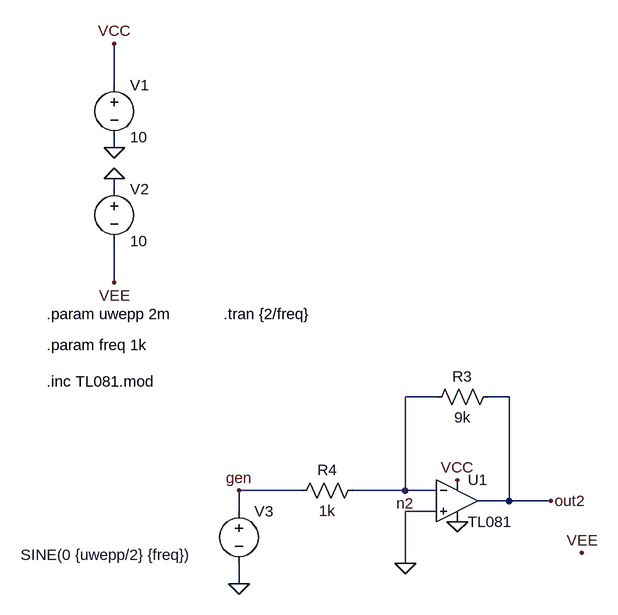
[diagram p0: schematic Draft1.asc]
Draft1.asc, the LTspice schematic file:
Version 4
SHEET 1 880 680
WIRE -128 -256 -128 -320
WIRE -128 -160 -128 -176
WIRE -128 -96 -128 -112
WIRE -128 48 -128 -16
WIRE 368 224 320 224
WIRE 480 224 448 224
WIRE 160 368 64 368
WIRE 320 368 320 224
WIRE 320 368 240 368
WIRE 368 368 320 368
WIRE 480 384 480 224
WIRE 480 384 432 384
WIRE 544 384 480 384
WIRE 64 400 64 368
WIRE 368 400 320 400
WIRE 320 480 320 400
WIRE 64 512 64 480
FLAG -128 -160 0
FLAG -128 -112 0
FLAG -128 -320 VCC
FLAG -128 48 VEE
FLAG 592 464 VEE
FLAG 400 352 VCC
FLAG 64 512 0
FLAG 320 480 0
FLAG 544 384 out2
FLAG 64 368 gen
FLAG 320 368 n2
FLAG 400 416 0
SYMBOL voltage -128 -272 R0
WINDOW 123 0 0 Left 0
WINDOW 39 0 0 Left 0
SYMATTR InstName V1
SYMATTR Value 10
SYMBOL voltage -128 -112 R0
WINDOW 123 0 0 Left 0
WINDOW 39 0 0 Left 0
SYMATTR InstName V2
SYMATTR Value 10
SYMBOL res 464 208 R90
WINDOW 0 0 56 VBottom 2
WINDOW 3 32 56 VTop 2
SYMATTR InstName R3
SYMATTR Value 9k
SYMBOL res 256 352 R90
WINDOW 0 0 56 VBottom 2
WINDOW 3 32 56 VTop 2
SYMATTR InstName R4
SYMATTR Value 1k
SYMBOL voltage 64 384 R0
WINDOW 3 -336 83 Left 2
WINDOW 123 0 0 Left 0
WINDOW 39 0 0 Left 0
SYMATTR Value SINE(0 {uwepp/2} {freq})
SYMATTR InstName V3
SYMBOL OpAmps\\opamp2 400 320 R0
SYMATTR InstName U1
SYMATTR Value TL081
TEXT -232 96 Left 2 !.param uwepp 2m
TEXT -232 144 Left 2 !.param freq 1k
TEXT 40 96 Left 2 !.tran {2/freq}
TEXT -232 200 Left 2 !.inc TL081.mod

The netlist it stands for:
* Draft1.asc
V1 VCC 0 10
V2 0 VEE 10
R3 out2 n2 9k
R4 n2 gen 1k
V3 gen 0 SINE(0 {uwepp/2} {freq})
XU1 0 n2 VCC 0 out2 TL081  ; pins In+ In- V+ V- OUT
.param uwepp 2m
.param freq 1k
.tran {2/freq}
.inc TL081.mod
.backanno
.end